# Altium project Subboard.PrjPCB (part 1 of 2)
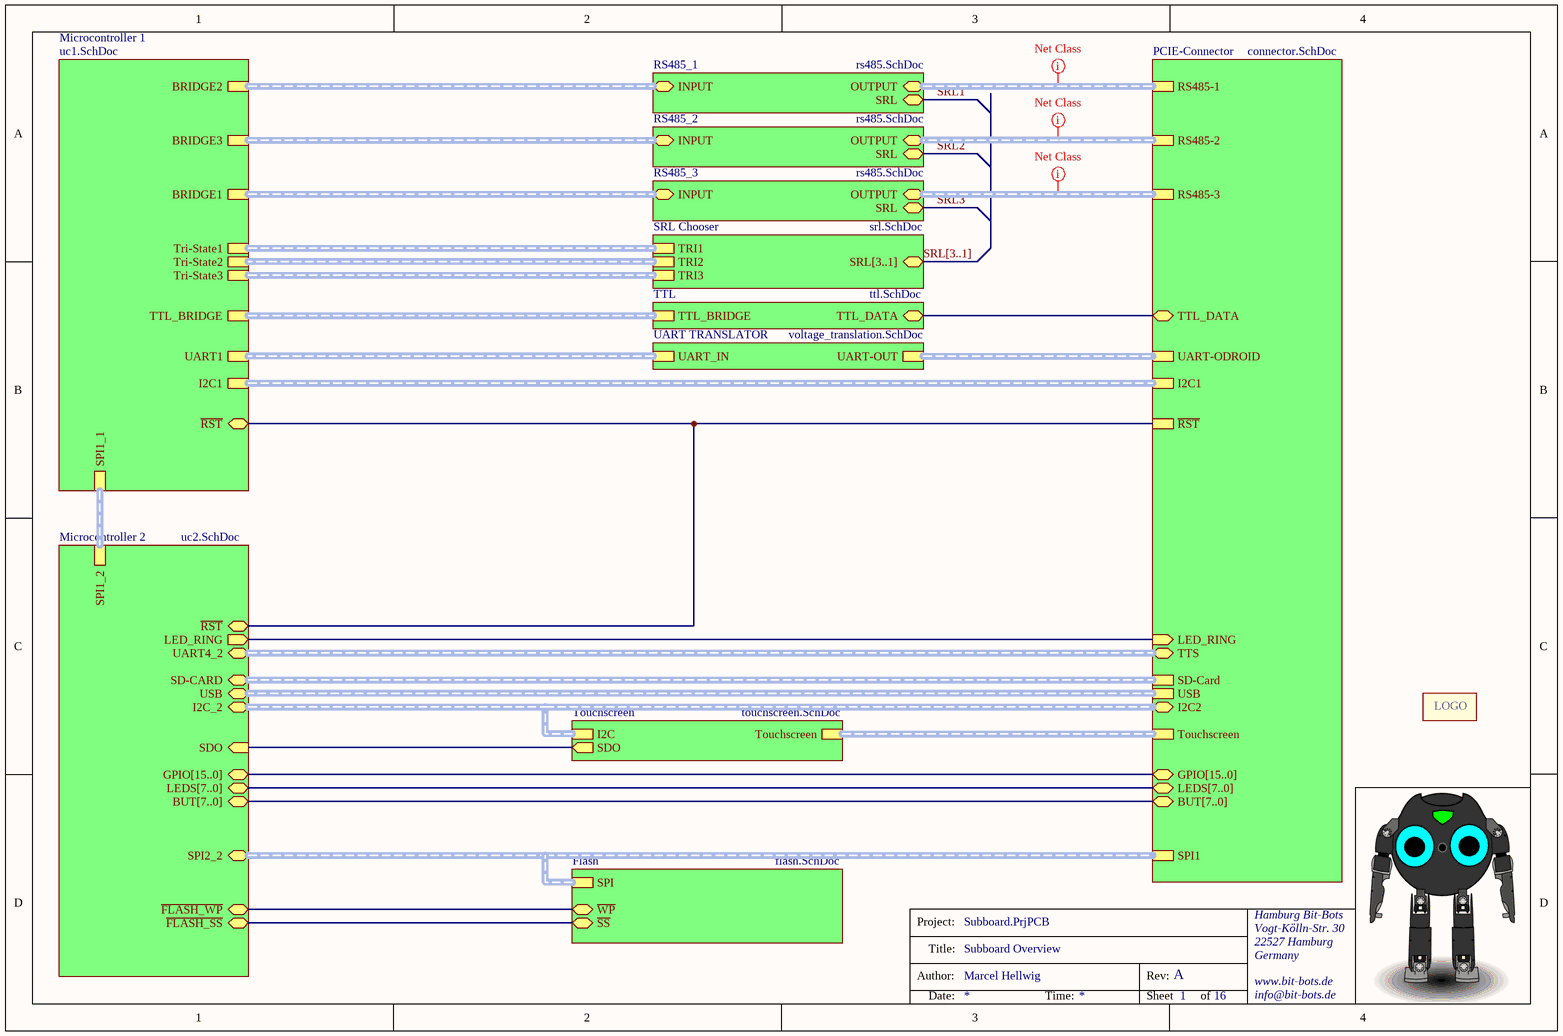
[diagram p0: TopLevel.SchDoc]
ProjectRevision: A
16 sheets, 166 parts. Net scope: hierarchical (ports join the sheet entries above them; power ports are global).
Board file: subboard.PcbDoc
Sheets:
  TopLevel.SchDoc
    RS485_3 = rs485.SchDoc
    PCIE-Connector = connector.SchDoc
    TTL = ttl.SchDoc
    Touchscreen = touchscreen.SchDoc
    RS485_1 = rs485.SchDoc
    RS485_2 = rs485.SchDoc
    SRL Chooser = srl.SchDoc
    UART TRANSLATOR = voltage_translation.SchDoc
    Microcontroller 1 = uc1.SchDoc
      1st Microcontroller = uc1A.SchDoc
      1st Microcontroller = uc1B.SchDoc
      1st Microcontroller = uc1C.SchDoc
    Microcontroller 2 = uc2.SchDoc
      2nd Microcontroller = uc2A.SchDoc
      2nd Microcontroller = uc2B.SchDoc
      2nd Microcontroller = uc2C.SchDoc
    Flash = flash.SchDoc

## Sheet TopLevel.SchDoc: Subboard Overview
size A4; Author: Marcel Hellwig; Organization: Hamburg Bit-Bots; Address1: Vogt-Kölln-Str. 30; Address2: 22527 Hamburg; Address3: Germany; Address4: www.bit-bots.de; DocumentNumber: 1; Revision: A; SheetNumber: 1; SheetTotal: 16; EMail: info@bit-bots.de

### Parts
Logo  Hamburg Bit-Bots Logo  [Logo]  (value not drawn)  (no BOM)

### Sub-sheets
Flash = flash.SchDoc: SPI (harness SPI), ~{WP} (bidir), ~{SS} (bidir)
Microcontroller 1 = uc1.SchDoc: BRIDGE1 (harness UART_RS485), BRIDGE2 (harness UART_RS485), BRIDGE3 (harness UART_RS485), TTL_BRIDGE (harness TTL), I2C1 (harness I²C), SPI1_1 (harness SPI), UART1 (harness UART), ~{RST}, Tri-State1 (harness Tri-State), Tri-State2 (harness Tri-State), Tri-State3 (harness Tri-State)
Microcontroller 2 = uc2.SchDoc: SPI1_2 (harness SPI), SD-CARD (harness SD-Card), USB (harness USB), I2C_2 (harness I²C), ~{RST}, SDO (in), GPIO[15..0] (bidir), LEDS[7..0] (bidir), BUT[7..0] (bidir), SPI2_2 (harness SPI), LED_RING (out), UART4_2 (harness UART), ~{FLASH_WP} (bidir), ~{FLASH_SS} (bidir)
PCIE-Connector = connector.SchDoc: LEDS[7..0] (bidir), BUT[7..0] (bidir), USB (harness USB), ~{RST}, SPI1 (harness SPI), UART-ODROID (harness UART), I2C1 (harness I²C), GPIO[15..0] (bidir), Touchscreen (harness Touchscreen), RS485-1 (harness RS-485), RS485-2 (harness RS-485), RS485-3 (harness RS-485), SD-Card (harness SD-Card), TTL_DATA (bidir), I2C2 (harness I²C), LED_RING (in), TTS (harness UART)
RS485_1 = rs485.SchDoc: SRL (bidir), INPUT (harness UART_RS485), OUTPUT (harness RS-485)
RS485_2 = rs485.SchDoc: SRL (bidir), INPUT (harness UART_RS485), OUTPUT (harness RS-485)
RS485_3 = rs485.SchDoc: SRL (bidir), INPUT (harness UART_RS485), OUTPUT (harness RS-485)
SRL Chooser = srl.SchDoc: SRL[3..1] (bidir), TRI1 (harness Tri-State), TRI2 (harness Tri-State), TRI3 (harness Tri-State)
Touchscreen = touchscreen.SchDoc: I2C (harness I²C), SDO (out), Touchscreen (harness Touchscreen)
TTL = ttl.SchDoc: TTL_BRIDGE (harness TTL), TTL_DATA (bidir)
UART TRANSLATOR = voltage_translation.SchDoc: UART-OUT (harness UART), UART_IN (harness UART)

### Nets
~{FLASH_SS}: sheet Microcontroller 2/~{FLASH_SS}, sheet Flash/~{SS}
~{FLASH_WP}: sheet Microcontroller 2/~{FLASH_WP}, sheet Flash/~{WP}
~{RST}: sheet PCIE-Connector/~{RST}, sheet Microcontroller 1/~{RST}, sheet Microcontroller 2/~{RST}
LED_RING: sheet PCIE-Connector/LED_RING, sheet Microcontroller 2/LED_RING
SDO: sheet Touchscreen/SDO, sheet Microcontroller 2/SDO
TTL_DATA: sheet PCIE-Connector/TTL_DATA, sheet TTL/TTL_DATA

### Buses and harness runs
bus sheet Microcontroller 2/BUT[7..0] = sheet PCIE-Connector/BUT[7..0]
bus sheet Microcontroller 2/GPIO[15..0] = sheet PCIE-Connector/GPIO[15..0]
bus sheet Microcontroller 2/LEDS[7..0] = sheet PCIE-Connector/LEDS[7..0]
bus SRL[3..1] = sheet SRL Chooser/SRL[3..1]
harness sheet Flash/SPI = sheet Microcontroller 2/SPI2_2 = sheet PCIE-Connector/SPI1
harness sheet Microcontroller 1/BRIDGE1 = sheet RS485_3/INPUT
harness sheet Microcontroller 1/BRIDGE2 = sheet RS485_1/INPUT
harness sheet Microcontroller 1/BRIDGE3 = sheet RS485_2/INPUT
harness sheet Microcontroller 1/I2C1 = sheet PCIE-Connector/I2C1
harness sheet Microcontroller 1/SPI1_1 = sheet Microcontroller 2/SPI1_2
harness sheet Microcontroller 1/Tri-State1 = sheet SRL Chooser/TRI1
harness sheet Microcontroller 1/Tri-State2 = sheet SRL Chooser/TRI2
harness sheet Microcontroller 1/Tri-State3 = sheet SRL Chooser/TRI3
harness sheet Microcontroller 1/TTL_BRIDGE = sheet TTL/TTL_BRIDGE
harness sheet Microcontroller 1/UART1 = sheet UART TRANSLATOR/UART_IN
harness sheet Microcontroller 2/I2C_2 = sheet PCIE-Connector/I2C2 = sheet Touchscreen/I2C
harness sheet Microcontroller 2/SD-CARD = sheet PCIE-Connector/SD-Card
harness sheet Microcontroller 2/UART4_2 = sheet PCIE-Connector/TTS
harness sheet Microcontroller 2/USB = sheet PCIE-Connector/USB
harness sheet PCIE-Connector/RS485-1 = sheet RS485_1/OUTPUT
harness sheet PCIE-Connector/RS485-2 = sheet RS485_2/OUTPUT
harness sheet PCIE-Connector/RS485-3 = sheet RS485_3/OUTPUT
harness sheet PCIE-Connector/Touchscreen = sheet Touchscreen/Touchscreen
harness sheet PCIE-Connector/UART-ODROID = sheet UART TRANSLATOR/UART-OUT

### Layout directives
net class RS485: (no net found under the mark)

### Notes on the sheet
- Project:
- Author:
- Title:
- Rev:
- Date:
- Time:
- Sheet
- of
- (in symbol Logo) LOGO

### Library data of the parts
Logo = Logo

## Sheet rs485.SchDoc: RS485
size A4; Author: Marcel Hellwig; Organization: Hamburg Bit-Bots; Address1: Vogt-Kölln-Str. 30; Address2: 22527 Hamburg; Address3: Germany; Address4: www.bit-bots.de; DocumentNumber: 11; Revision: A; SheetNumber: 11; SheetTotal: 16; EMail: info@bit-bots.de
Used 3 times, as channels RS485_3, RS485_1, RS485_2. Parts and nets are listed once, with the designators drawn on the sheet.
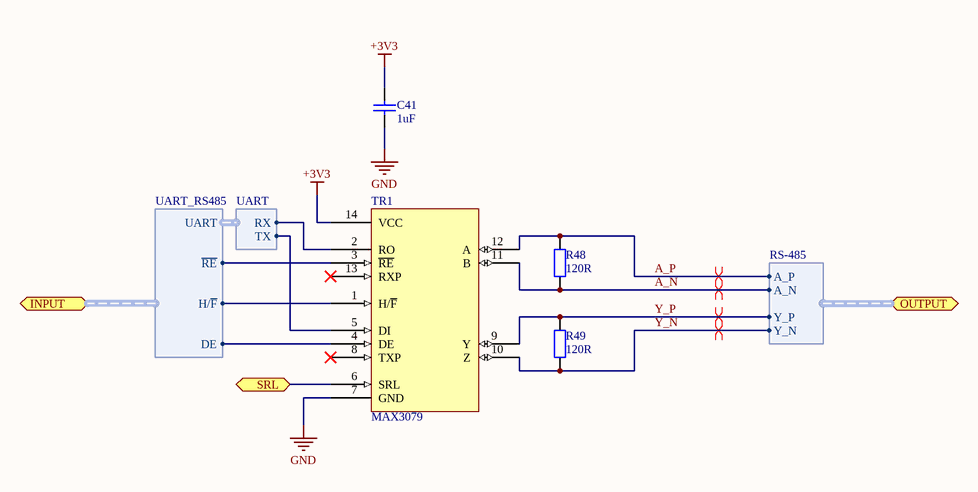
[diagram p1: rs485.SchDoc]

### Parts
C41  1uF  [C2012]
R48  120R  [R2012]
R49  120R  [R2012]
TR1  MAX3079  [SOIC14]

### Ports
INPUT (harness UART_RS485), OUTPUT (harness RS-485), SRL (bidir)

### Harnesses
UART_RS485: ~{RE}, UART, DE, H/~{F}
UART: RX, TX
RS-485: A_N, A_P, Y_N, Y_P

### Nets
+3V3: C41.1 TR1.14(VCC)
GND: C41.2 TR1.7(GND)
A_N: R48.1 TR1.11(B) ; port OUTPUT.A_N
A_P: R48.2 TR1.12(A) ; port OUTPUT.A_P
SRL: TR1.6(SRL) ; port SRL
Y_N: R49.2 TR1.10(Z) ; port OUTPUT.Y_N
Y_P: R49.1 TR1.9(Y) ; port OUTPUT.Y_P
NetTR1_1: TR1.1(H/~{F}) ; port INPUT.H/~{F}
NetTR1_2: TR1.2(RO) ; harness UART.RX
NetTR1_3: TR1.3(~{RE}) ; port INPUT.~{RE}
NetTR1_4: TR1.4(DE) ; port INPUT.DE
NetTR1_5: TR1.5(DI) ; harness UART.TX

Not connected (* = marked no-connect by the designer): TR1 8(TXP)* 13(RXP)*

### Channels
RS485_3: designators end in 1; ports SRL=SRL3
RS485_1: designators end in 2; ports SRL=SRL1
RS485_2: designators end in 3; ports SRL=SRL2

### Layout directives
differential pair: A_N, A_P, Y_N, Y_P

### Notes on the sheet
- Project:
- Author:
- Title:
- Rev:
- Date:
- Time:
- Sheet
- of

### Library data of the parts
C41 = Cap: Capacitor; Manufacturer: MULTICOMP; Manufacturer Part Number: MC0805B105K250CT; Produktpalette: Baureihe MC; Kapazität: 1; Kapazitätstoleranz: ±10%; Dielektrikum: X7; Nennspannung: 25; Keramikkondensatorgehäuse: 0805 [Metrisch 2012]; Betriebstemperatur, min.: -55; Betriebstemperatur, max.: 125; Verpackung: Gurtabschnitt; Kondensatoranschlüsse: SMD<!--FANDB--><div class="features-and-benefits-container"></div>; Published: 8-Jun-2000; LatestRevisionDate: 17-Jul-2002; LatestRevisionNote: Re-released for DXP Platform.; PackageReference: RAD-0.3; Publisher: Altium Limited; PackageDescription: Radial Cap, Thru-Hole; 2 Leads; 0.3 in Pin Spacing; Value: 1uF; Supplier 1: Farnell; Supplier Part Number 1: 2320827; RoHS: YES; Stock 1: 4031; Pricing 1: 10=0,06, 100=0,05, 500=0,041, 1000=0,034, 1500=0,027 (EUR); MSL: MSL 1 - unbegrenzt; Bauform: 0805 [Metrisch 2012]; Kapazitätstoleranz ±: ±10%; ComponentLink1URL: http://www.farnell.com/datasheets/1870456.pdf; ComponentLink1Description: http://www.farnell.com/datasheets/1870456.pdf
R48 R49 = Res2: Resistor; Manufacturer: MULTICOMP; Manufacturer Part Number: MCMR08X1200FTL; Produktpalette: Baureihe MCMR; Widerstand: 120; Nennleistung: 125; Widerstandstoleranz: ±1%; Bauform: 0805 [Metrisch 2012]; Widerstandselement: Keramik; Temperaturkoeffizient: ±100; Nennspannung: 150; Verpackung: Gurtabschnitt; SVHC: No SVHC (17-Dec-2014); Widerstandsmontage: Oberflächenmontage<!--FANDB--><div class="features-and-benefits-container"></div>; Published: 8-Jun-2000; LatestRevisionDate: 17-Jul-2002; LatestRevisionNote: Re-released for DXP Platform.; PackageReference: AXIAL-0.4; Publisher: Altium Limited; PackageDescription: Axial Device, Thru-Hole; 2 Leads; 0.4 in Pin Spacing; Value: 120R; Supplier 1: Farnell; Supplier Part Number 1: 2073624; RoHS: YES; Stock 1: 7400; Pricing 1: 100=0,014, 500=0,011, 1000=0,01 (EUR); MSL: -; ComponentLink1URL: http://www.farnell.com/datasheets/1716708.pdf; ComponentLink1Description: http://www.farnell.com/datasheets/1716708.pdf
TR1 = MAX3079: MAX3079 RS485-Transreceiver; Supplier 1: Farnell; Supplier Part Number 1: 1379892

## Sheet connector.SchDoc: PCIE-Connector
size A4; Author: Marcel Hellwig; Organization: Hamburg Bit-Bots; Address1: Vogt-Kölln-Str. 30; Address2: 22527 Hamburg; Address3: Germany; Address4: www.bit-bots.de; DocumentNumber: 10; Revision: A; SheetNumber: 10; SheetTotal: 16; EMail: info@bit-bots.de
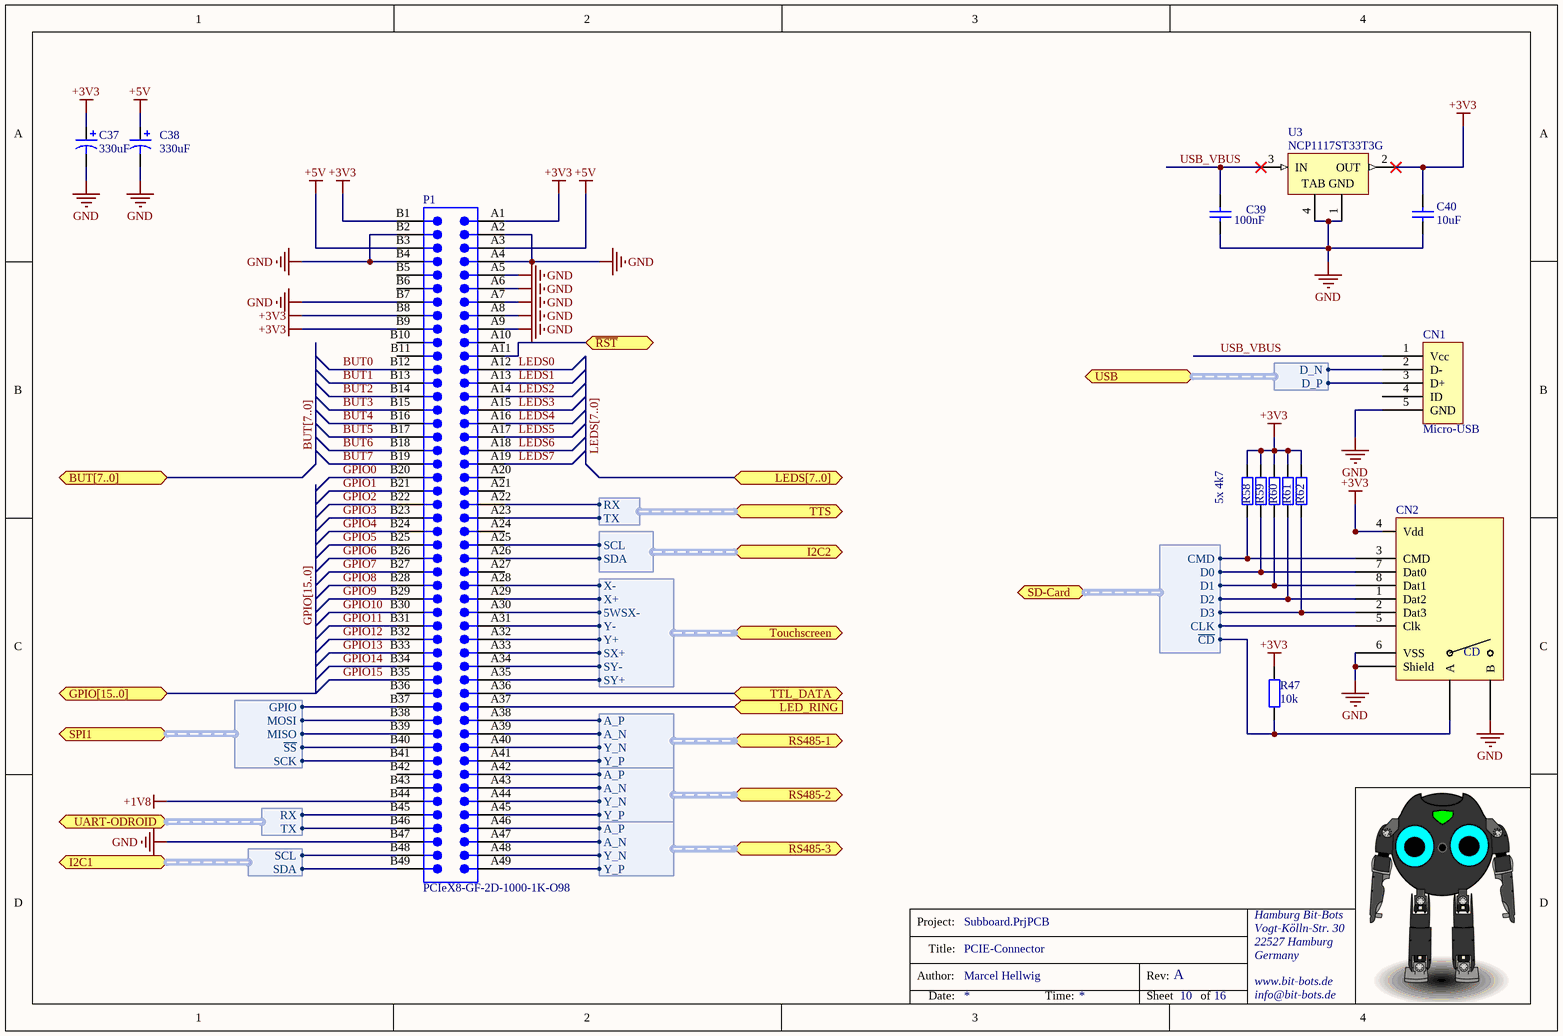
[diagram p2: connector.SchDoc]

### Parts
C37  330uF  [Cap 10mm]
C38  330uF  [Cap 10mm]
C39  100nF  [C2012]
C40  10uF  [C2012]
CN1  Micro-USB  [USB-MicroB]
CN2  microSD  [Microsd]  (value not drawn)
P1  PCIeX8-GF-2D-1000-1K-O98  [PCIeX8-GF-2D-1000-1K-O98]  (no BOM)
R47  10k  [R2012]
R58  4k7  [R2012]  (value not drawn)
R59  4k7  [R2012]  (value not drawn)
R60  4k7  [R2012]  (value not drawn)
R61  4k7  [R2012]  (value not drawn)
R62  4k7  [R2012]  (value not drawn)
U3  NCP1117ST33T3G  [ONSC-SOT-223_L]

### Ports
BUT[7..0] (bidir), GPIO[15..0] (bidir), I2C1 (harness I²C), I2C2 (harness I²C), LED_RING (in), LEDS[7..0] (bidir), RS485-1 (harness RS-485), RS485-2 (harness RS-485), RS485-3 (harness RS-485), SD-Card (harness SD-Card), SPI1 (harness SPI), Touchscreen (harness Touchscreen), TTL_DATA (bidir), TTS (harness UART), UART-ODROID (harness UART), USB (harness USB), ~{RST}

### Harnesses
USB: D_N, D_P
UART: RX, TX
I²C: SCL, SDA
Touchscreen: 5WSX-, SX+, SY-, SY+, X-, X+, Y-, Y+
RS-485: A_P, A_N, Y_P, Y_N
SD-Card: CLK, CMD, D0, D1, D2, D3, ~{CD}
SPI: ~{SS}, GPIO, MISO, MOSI, SCK

### Nets
+1V8: P1.B44
+3V3: C37.1 C40.2 CN2.4(Vdd) P1.A1 P1.B1 P1.B8 P1.B9 R47.2 R58.1 R59.1 R60.1 R61.1 R62.1 U3.2(OUT)
+5V: C38.1 P1.A3 P1.B3
GND: C37.2 C38.2 C39.1 C40.1 CN1.5(GND) CN2.6(VSS) CN2.B CN2.sh(Shield) P1.A2 P1.A4 P1.A5 P1.A6 P1.A7 P1.A8 P1.A9 P1.B2 P1.B4 P1.B7 P1.B47 U3.1(GND) U3.4(TAB)
~{RST}: P1.A11 ; port ~{RST}
A_N: P1.A47 ; port RS485-3.A_N
A_N: P1.A39 ; port RS485-1.A_N  [a separate net that carries the same name]
A_N: P1.A43 ; port RS485-2.A_N  [a separate net that carries the same name]
A_P: P1.A46 ; port RS485-3.A_P
A_P: P1.A38 ; port RS485-1.A_P  [a separate net that carries the same name]
A_P: P1.A42 ; port RS485-2.A_P  [a separate net that carries the same name]
BUT0: P1.B12
BUT1: P1.B13
BUT2: P1.B14
BUT3: P1.B15
BUT4: P1.B16
BUT5: P1.B17
BUT6: P1.B18
BUT7: P1.B19
GPIO0: P1.B20
GPIO1: P1.B21
GPIO2: P1.B22
GPIO3: P1.B23
GPIO4: P1.B24
GPIO5: P1.B25
GPIO6: P1.B26
GPIO7: P1.B27
GPIO8: P1.B28
GPIO9: P1.B29
GPIO10: P1.B30
GPIO11: P1.B31
GPIO12: P1.B32
GPIO13: P1.B33
GPIO14: P1.B34
GPIO15: P1.B35
LED_RING: P1.A37 ; port LED_RING
LEDS0: P1.A12
LEDS1: P1.A13
LEDS2: P1.A14
LEDS3: P1.A15
LEDS4: P1.A16
LEDS5: P1.A17
LEDS6: P1.A18
LEDS7: P1.A19
SD-CARD.CMD: CN2.3(CMD) R58.2 ; port SD-Card.CMD
SPI2~{.}SS: P1.B40 ; port SPI1.~{SS}
SPI2.GPIO: P1.B37 ; port SPI1.GPIO
SPI2.SCK: P1.B41 ; port SPI1.SCK
Touchscreen.X-: P1.A28 ; port Touchscreen.X-
TTL_DATA: P1.A36 ; port TTL_DATA
USB_VBUS: C39.2 CN1.1(Vcc) U3.3(IN)
Y_N: P1.A48 ; port RS485-3.Y_N
Y_N: P1.A40 ; port RS485-1.Y_N  [a separate net that carries the same name]
Y_N: P1.A44 ; port RS485-2.Y_N  [a separate net that carries the same name]
Y_P: P1.A49 ; port RS485-3.Y_P
Y_P: P1.A41 ; port RS485-1.Y_P  [a separate net that carries the same name]
Y_P: P1.A45 ; port RS485-2.Y_P  [a separate net that carries the same name]
NetC47_2: P1.A30 ; port Touchscreen.5WSX-
NetC48_2: P1.A31 ; port Touchscreen.Y-
NetC49_2: P1.A34 ; port Touchscreen.SY-
NetCN1_2: CN1.2(D-) ; port USB.D_N
NetCN1_3: CN1.3(D+) ; port USB.D_P
NetCN2_1: CN2.1(Dat2) R61.2 ; port SD-Card.D2
NetCN2_2: CN2.2(Dat3) R62.2 ; port SD-Card.D3
NetCN2_5: CN2.5(Clk) ; port SD-Card.CLK
NetCN2_7: CN2.7(Dat0) R59.2 ; port SD-Card.D0
NetCN2_8: CN2.8(Dat1) R60.2 ; port SD-Card.D1
NetCN2_A: CN2.A R47.1 ; port SD-Card.~{CD}
NetP1_A22: P1.A22 ; port TTS.RX
NetP1_A23: P1.A23 ; port TTS.TX
NetP1_A25: P1.A25 ; port I2C2.SCL
NetP1_A26: P1.A26 ; port I2C2.SDA
NetP1_A29: P1.A29 ; port Touchscreen.X+
NetP1_A32: P1.A32 ; port Touchscreen.Y+
NetP1_A33: P1.A33 ; port Touchscreen.SX+
NetP1_A35: P1.A35 ; port Touchscreen.SY+
NetP1_B38: P1.B38 ; port SPI1.MOSI
NetP1_B39: P1.B39 ; port SPI1.MISO
NetP1_B45: P1.B45 ; port UART-ODROID.RX
NetP1_B46: P1.B46 ; port UART-ODROID.TX
NetP1_B48: P1.B48 ; port I2C1.SCL
NetP1_B49: P1.B49 ; port I2C1.SDA

Not connected (* = marked no-connect by the designer): CN1 4(ID); P1 A10 A20 A21 A24 A27 B5 B6 B10 B11 B36 B42 B43

### Buses and harness runs
bus BUT[7..0] = port BUT[7..0]
bus GPIO[15..0] = port GPIO[15..0]
bus LEDS[7..0] = port LEDS[7..0]

### Notes on the sheet
- 5x 4k7
- Project:
- Author:
- Title:
- Rev:
- Date:
- Time:
- Sheet
- of
- (in symbol microSD) CD

### Library data of the parts
C37 C38 = Cap Pol1: Polarized Capacitor (Radial); Manufacturer: PANASONIC ELECTRONIC COMPONENTS; Manufacturer Part Number: EEE1VA331UAP; Published: 8-Jun-2000; LatestRevisionDate: 17-Jul-2002; LatestRevisionNote: Re-released for DXP Platform.; PackageReference: RB7.6-15; Publisher: Altium Limited; PackageDescription: Polarized Capacitor (Radial); 2 Leads; Value: 330uF; Supplier 1: Farnell; Supplier Part Number 1: 2326180; RoHS: YES; Stock 1: 534; Pricing 1: 1=0,89, 10=0,619, 50=0,445, 100=0,309, 250=0,279, 500=0,259, 2500=0,219, 5000=0,195 (EUR); ComponentLink1URL: http://www.farnell.com/datasheets/1790637.pdf; ComponentLink1Description: http://www.farnell.com/datasheets/1790637.pdf
C39 = Cap: Capacitor; Manufacturer: MULTICOMP; Manufacturer Part Number: MC0805B104K500CT; Produktpalette: Baureihe MC; Kapazität: 0.1; Kapazitätstoleranz: ±10%; Dielektrikum: X7; Nennspannung: 50; Keramikkondensatorgehäuse: 0805 [Metrisch 2012]; Betriebstemperatur, min.: -55; Betriebstemperatur, max.: 125; Verpackung: Gurtabschnitt; SVHC: No SVHC (17-Dec-2014); Betriebstemperatur: -55°C bis +125; Kondensatoranschlüsse: SMD<!--FANDB--><div class="features-and-benefits-container"></div>; Published: 8-Jun-2000; LatestRevisionDate: 17-Jul-2002; LatestRevisionNote: Re-released for DXP Platform.; PackageReference: RAD-0.3; Publisher: Altium Limited; PackageDescription: Radial Cap, Thru-Hole; 2 Leads; 0.3 in Pin Spacing; Value: 100nF; Supplier 1: Farnell; Supplier Part Number 1: 1759265; RoHS: YES; Stock 1: 692587; Pricing 1: 10=0,013, 100=0,011, 500=0,009, 1000=0,008, 2000=0,006 (EUR); MSL: -; Bauform: 0805 [Metrisch 2012]; Kapazitätstoleranz ±: ±10%; ComponentLink1URL: http://www.farnell.com/datasheets/1870456.pdf; ComponentLink1Description: http://www.farnell.com/datasheets/1870456.pdf
C40 = Cap: Capacitor; Manufacturer: MULTICOMP; Manufacturer Part Number: MC0805X106K250CT; Produktpalette: Baureihe MC; Kapazität: 10; Kapazitätstoleranz: ±10%; Dielektrikum: X5; Nennspannung: 25; Keramikkondensatorgehäuse: 0805 [Metrisch 2012]; Betriebstemperatur, min.: -55; Betriebstemperatur, max.: 85; Verpackung: Gurtabschnitt; Kondensatoranschlüsse: SMD<!--FANDB--><div class="features-and-benefits-container"></div>; Published: 8-Jun-2000; LatestRevisionDate: 17-Jul-2002; LatestRevisionNote: Re-released for DXP Platform.; PackageReference: RAD-0.3; Publisher: Altium Limited; PackageDescription: Radial Cap, Thru-Hole; 2 Leads; 0.3 in Pin Spacing; Value: 10uF; Supplier 1: Farnell; Supplier Part Number 1: 2320833; RoHS: YES; Stock 1: 46180; Pricing 1: 10=0,147, 100=0,121, 500=0,1, 1000=0,083, 1500=0,066 (EUR); MSL: MSL 1 - unbegrenzt; Bauform: 0805 [Metrisch 2012]; Kapazitätstoleranz ±: ±10%; ComponentLink1URL: http://www.farnell.com/datasheets/1870456.pdf; ComponentLink1Description: http://www.farnell.com/datasheets/1870456.pdf
CN1 = USB-MicroB: Manufacturer: Molex; Manufacturer Part Number: 105017-0001; Verbindungstyp: Micro USB Type B Receptacle; Kontaktüberzug: Gold; Nennstrom: 1.8 A; Anschlussart: Male; Anzahl der Kontakte: 5; Verpackung: Reel; Produkt: Micro USB Type B Connectors; Serie: 105017; Klemmenart: Solder Tab; Nennspannung: 30 VAC; Kontaktmaterial: Copper Alloy; Anzahl der Ports: 1; Produktkategorie: USB Connectors; Supplier 1: Mouser; Supplier Part Number 1: 538-105017-0001; RoHS: RoHS Compliant; Category: USB-Stecker; Stock 1: 8793; Pricing 1: 1=0.787, 10=0.691, 25=0.650, 50=0.623, 100=0.595, 250=0.507, 500=0.480, 1000=0.389, 2000=0.326 (EUR); Fabrikat: Molex; Hersteller: Molex; Standardpackungsmenge: 14000; RoHS - Mouser: Y; Minimum Order Quantity: 1; Reeling: True; ComponentLink1URL: http://www.mouser.com/ds/2/276/1050170001_IO_CONNECTORS-230168.pdf; ComponentLink1Description: http://www.mouser.com/ds/2/276/1050170001_IO_CONNECTORS-230168.pdf
CN2 = microSD: Micro SD Card Connector; Supplier 1: Farnell; Supplier Part Number 1: 2427719
P1 = CMP-0001-00032-2: Golden finger, PCIeX8, Dual, Opposite, Pitch 1mm, 98-Position; Mating Connector: Molex-87715-9205; Datasheet Version: rev2.0, Apr-2007; ClassName: Edge Connector; Publisher: Altium; Package Reference: PCIeX8-GF-2D-1000-1K-O98
R47 = Res2: Resistor; Manufacturer: MULTICOMP; Manufacturer Part Number: MC01W0805110K; Published: 8-Jun-2000; LatestRevisionDate: 17-Jul-2002; LatestRevisionNote: Re-released for DXP Platform.; PackageReference: AXIAL-0.4; Publisher: Altium Limited; PackageDescription: Axial Device, Thru-Hole; 2 Leads; 0.4 in Pin Spacing; Value: 10k; Supplier 1: Farnell; Supplier Part Number 1: 9332391; RoHS: Y-EX; Stock 1: 4370; Pricing 1: 50=0,038, 250=0,031, 1000=0,022, 5000=0,014, 15000=0,009 (EUR); ComponentLink1URL: http://www.farnell.com/datasheets/1729047.pdf; ComponentLink1Description: http://www.farnell.com/datasheets/1729047.pdf; ComponentLink2URL: http://www.farnell.com/cad/1561156.zip; ComponentLink2Description: http://www.farnell.com/cad/1561156.zip
R58-R62 = Res2: Resistor; Manufacturer: MULTICOMP; Manufacturer Part Number: MC01W080514K7; Produktpalette: Baureihe MC; Widerstand: 4.7; Nennleistung: 100; Widerstandstoleranz: ±1%; Bauform: 0805 [Metrisch 2012]; Widerstandselement: Dickschicht; Temperaturkoeffizient: ±100; Nennspannung: 150; Verpackung: Gurtabschnitt; SVHC: No SVHC (17-Dec-2014); Anzahl der Pins: 2; Außenbreite: 1.25; Außentiefe: 0.55; Bandbreite: 8; Baureihe: MC; Betriebstemperatur: -55°C bis +155; Betriebstemperatur, max.: 155; Betriebstemperatur, min.: -55; Menge pro Rolle: 5000; Toleranz (+): 1%; Widerstandsmontage: Oberflächenmontage<!--FANDB--><div class="features-and-benefits-container"></div>; Published: 8-Jun-2000; LatestRevisionDate: 17-Jul-2002; LatestRevisionNote: Re-released for DXP Platform.; PackageReference: AXIAL-0.4; Publisher: Altium Limited; PackageDescription: Axial Device, Thru-Hole; 2 Leads; 0.4 in Pin Spacing; Value: 4k7; Supplier 1: Farnell; Supplier Part Number 1: 9333266; RoHS: Y-EX; Stock 1: 190984; Pricing 1: 50=0,038, 250=0,031, 1000=0,022, 5000=0,014, 15000=0,009 (EUR); MSL: -; Außenlänge/-höhe: 2; Nennspannung, V DC: 150; Temperaturkoeffizient, +: 100; Temperaturkoeffizient, -: 100; Toleranz (-): 1%; ComponentLink1URL: http://www.farnell.com/datasheets/1729047.pdf; ComponentLink1Description: http://www.farnell.com/datasheets/1729047.pdf; ComponentLink2URL: http://www.farnell.com/cad/1561170.zip; ComponentLink2Description: http://www.farnell.com/cad/1561170.zip
U3 = CMP-0592-00001-2: 1.0 A Low-Dropout Positive Fixed Voltage Regulator, 5 V Vout, 0 to 125 degC, 4-Pin SOT-223, Pb-Free, Tape and Reel; PartNumber: NCP1117ST50T3G; Manufacturer: ON Semiconductor; IQ: 6 mA; Iout (Min): 1 A; Nominal Output Voltage: 3.3 V; Vin: 20 V; RR: 61 dB; Dropout Voltage: 1.2 V; Packing: Tape and Reel; DatasheetVersion: Rev. 26; ComponentLink3URL: http://www.onsemi.com/pub_link/Collateral/318H-01.PDF; ComponentLink2URL: http://www.onsemi.com/pub_link/Collateral/NCP1117-D.PDF; Mounting Technology: Surface Mount; ComponentLink2Description: Datasheet; Operating Temperature: 0 to 125 degC; ComponentLink1Description: Manufacturer URL; PackageDescription: 4-Pin Small Out-Line Transistor, Body 3.5 x 6.5 mm, Pitch 2.3 mm; ComponentLink1URL: http://www.onsemi.com/; PackageReference: SOT-223; ComponentLink3Description: Package Specification; Supplier 1: Farnell; Supplier Part Number 1: 1652366

## Sheet ttl.SchDoc: TTL
size A4; Author: Marcel Hellwig; Organization: Hamburg Bit-Bots; Address1: Vogt-Kölln-Str. 30; Address2: 22527 Hamburg; Address3: Germany; Address4: www.bit-bots.de; DocumentNumber: 13; Revision: A; SheetNumber: 13; SheetTotal: 16; EMail: info@bit-bots.de
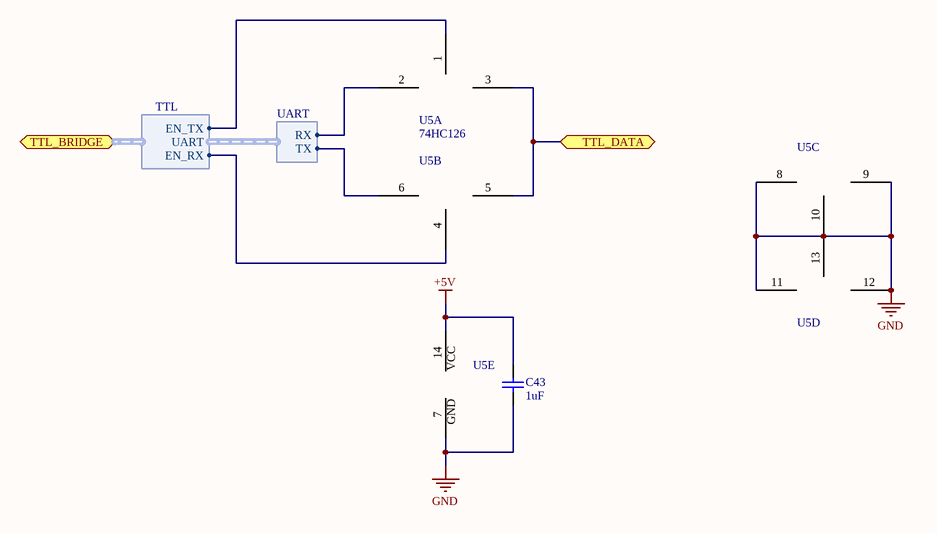
[diagram p3: ttl.SchDoc]

### Parts
C43  1uF  [C2012]
U5  74HC126  [SOIC14]  (parts A,B,C,D,E of 5)

### Ports
TTL_BRIDGE (harness TTL), TTL_DATA (bidir)

### Harnesses
TTL: UART, EN_RX, EN_TX
UART: RX, TX

### Nets
+5V: C43.1 U5.14(VCC)
GND: C43.2 U5.7(GND) U5.8(Y3) U5.9(A3) U5.10(OE3) U5.11(Y4) U5.12(A4) U5.13(OE4)
TTL_BRIDGE.EN_RX: U5.4(OE2) ; port TTL_BRIDGE.EN_RX
TTL_BRIDGE.EN_TX: U5.1(OE1) ; port TTL_BRIDGE.EN_TX
TTL_DATA: U5.3(Y1) U5.5(A2) ; port TTL_DATA
NetU1_96: U5.6(Y2) ; harness UART.TX
NetU1_97: U5.2(A1) ; harness UART.RX

### Notes on the sheet
- Project:
- Author:
- Title:
- Rev:
- Date:
- Time:
- Sheet
- of

### Library data of the parts
C43 = Cap: as C41 on sheet rs485; Published: 8-Jun-2000; LatestRevisionDate: 17-Jul-2002; LatestRevisionNote: Re-released for DXP Platform.; PackageReference: RAD-0.3; Publisher: Altium Limited; PackageDescription: Radial Cap, Thru-Hole; 2 Leads; 0.3 in Pin Spacing; Value: 1uF; Supplier 1: Farnell; Supplier Part Number 1: 2320827; RoHS: YES; Stock 1: 4031; Pricing 1: 10=0,06, 100=0,05, 500=0,041, 1000=0,034, 1500=0,027 (EUR); MSL: MSL 1 - unbegrenzt; Bauform: 0805 [Metrisch 2012]; Kapazitätstoleranz ±: ±10%; ComponentLink1URL: http://www.farnell.com/datasheets/1870456.pdf; ComponentLink1Description: http://www.farnell.com/datasheets/1870456.pdf
U5 = 74HC126: Quad 3-State Noninverting Buffer; Manufacturer: NXP; Manufacturer Part Number: 74HC126D; Supplier 1: Farnell; Supplier Part Number 1: 1085233; RoHS: YES; Stock 1: 198; Pricing 1: 1=0,444, 10=0,311, 100=0,214, 200=0,193, 500=0,173, 2000=0,155, 5000=0,0826, 20000=0,0733 (EUR); ComponentLink1URL: http://www.farnell.com/datasheets/1852048.pdf; ComponentLink1Description: http://www.farnell.com/datasheets/1852048.pdf; ComponentLink2URL: http://www.farnell.com/cad/1638396.zip; ComponentLink2Description: http://www.farnell.com/cad/1638396.zip

## Sheet touchscreen.SchDoc: Touchscreen
size A4; Author: Marcel Hellwig; Organization: Hamburg Bit-Bots; Address1: Vogt-Kölln-Str. 30; Address2: 22527 Hamburg; Address3: Germany; Address4: www.bit-bots.de; DocumentNumber: 14; Revision: A; SheetNumber: 14; SheetTotal: 16; EMail: info@bit-bots.de
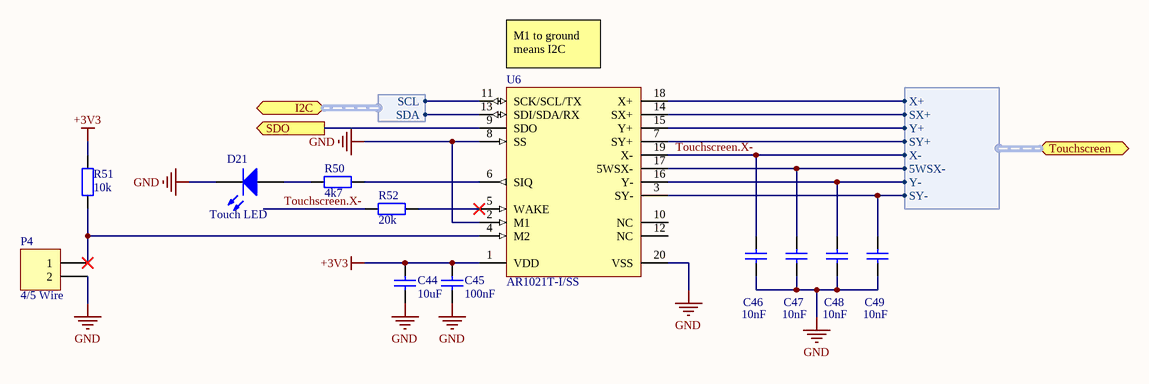
[diagram p4: touchscreen.SchDoc]

### Parts
C44  10uF  [C2012]
C45  100nF  [C2012]
C46  10nF  [C2012]
C47  10nF  [C2012]
C48  10nF  [C2012]
C49  10nF  [C2012]
D21  Touch LED  [MLCC2]
P4  4/5 Wire  [HDR1X2]  (no BOM)
R50  4k7  [R2012]
R51  10k  [R2012]
R52  20k  [R2012]
U6  AR1021T-I/SS  [MCHP-SSOP-SS20_N]

### Ports
I2C (harness I²C), SDO (out), Touchscreen (harness Touchscreen)

### Harnesses
I²C: SCL, SDA
Touchscreen: X+, SX+, Y+, SY+, X-, 5WSX-, Y-, SY-

### Nets
+3V3: C44.1 C45.1 R51.2 U6.1(VDD)
GND: C44.2 C45.2 C46.1 C47.1 C48.1 C49.1 D21.2(K) P4.2 U6.2(M1) U6.8(SS) U6.20(VSS)
SDO: U6.9(SDO) ; port SDO
Touchscreen.X-: C46.2 R52.1 U6.19(X-) ; port Touchscreen.X-
NetC47_2: C47.2 U6.17(5WSX-) ; port Touchscreen.5WSX-
NetC48_2: C48.2 U6.16(Y-) ; port Touchscreen.Y-
NetC49_2: C49.2 U6.3(SY-) ; port Touchscreen.SY-
NetD21_1: D21.1(A) R50.1
NetP1_A25: U6.11(SCK/SCL/TX) ; port I2C.SCL
NetP1_A26: U6.13(SDI/SDA/RX) ; port I2C.SDA
NetP1_A29: U6.18(X+) ; port Touchscreen.X+
NetP1_A32: U6.15(Y+) ; port Touchscreen.Y+
NetP1_A33: U6.14(SX+) ; port Touchscreen.SX+
NetP1_A35: U6.7(SY+) ; port Touchscreen.SY+
NetP4_1: P4.1 R51.1 U6.4(M2)
NetR50_2: R50.2 U6.6(SIQ)
NetR52_2: R52.2 U6.5(WAKE)

Not connected (* = marked no-connect by the designer): U6 10(NC) 12(NC)

### Notes on the sheet
- (near U6) M1 to ground means I2C
- Project:
- Author:
- Title:
- Rev:
- Date:
- Time:
- Sheet
- of

### Library data of the parts
C44 = Cap: as C40 on sheet connector; Published: 8-Jun-2000; LatestRevisionDate: 17-Jul-2002; LatestRevisionNote: Re-released for DXP Platform.; PackageReference: RAD-0.3; Publisher: Altium Limited; PackageDescription: Radial Cap, Thru-Hole; 2 Leads; 0.3 in Pin Spacing; Value: 10uF; Supplier 1: Farnell; Supplier Part Number 1: 2320833; RoHS: YES; Stock 1: 46180; Pricing 1: 10=0,147, 100=0,121, 500=0,1, 1000=0,083, 1500=0,066 (EUR); MSL: MSL 1 - unbegrenzt; Bauform: 0805 [Metrisch 2012]; Kapazitätstoleranz ±: ±10%; ComponentLink1URL: http://www.farnell.com/datasheets/1870456.pdf; ComponentLink1Description: http://www.farnell.com/datasheets/1870456.pdf
C45 = Cap: as C39 on sheet connector; Published: 8-Jun-2000; LatestRevisionDate: 17-Jul-2002; LatestRevisionNote: Re-released for DXP Platform.; PackageReference: RAD-0.3; Publisher: Altium Limited; PackageDescription: Radial Cap, Thru-Hole; 2 Leads; 0.3 in Pin Spacing; Value: 100nF; Supplier 1: Farnell; Supplier Part Number 1: 1759265; RoHS: YES; Stock 1: 692437; Pricing 1: 10=0,013, 100=0,011, 500=0,009, 1000=0,008, 2000=0,006 (EUR); MSL: -; Bauform: 0805 [Metrisch 2012]; Kapazitätstoleranz ±: ±10%; ComponentLink1URL: http://www.farnell.com/datasheets/1870456.pdf; ComponentLink1Description: http://www.farnell.com/datasheets/1870456.pdf
C46-C49 = Cap: Capacitor; Manufacturer: MULTICOMP; Manufacturer Part Number: MC0805B103K500CT; Produktpalette: Baureihe MC; Kapazität: 0.01; Kapazitätstoleranz: ±10%; Dielektrikum: X7; Nennspannung: 50; Keramikkondensatorgehäuse: 0805 [Metrisch 2012]; Betriebstemperatur, min.: -55; Betriebstemperatur, max.: 125; Verpackung: Gurtabschnitt; SVHC: No SVHC (17-Dec-2014); Betriebstemperatur: -55°C bis +125; Kondensatoranschlüsse: SMD<!--FANDB--><div class="features-and-benefits-container"></div>; Published: 8-Jun-2000; LatestRevisionDate: 17-Jul-2002; LatestRevisionNote: Re-released for DXP Platform.; PackageReference: RAD-0.3; Publisher: Altium Limited; PackageDescription: Radial Cap, Thru-Hole; 2 Leads; 0.3 in Pin Spacing; Value: 10nF; Supplier 1: Farnell; Supplier Part Number 1: 1759246; RoHS: YES; Stock 1: 268277; Pricing 1: 10=0,013, 100=0,011, 500=0,009, 1000=0,008, 2000=0,006 (EUR); MSL: -; Bauform: 0805 [Metrisch 2012]; Kapazitätstoleranz ±: ±10%; ComponentLink1URL: http://www.farnell.com/datasheets/1870456.pdf; ComponentLink1Description: http://www.farnell.com/datasheets/1870456.pdf
D21 = LED0: Typical INFRARED GaAs LED; Manufacturer: VISHAY; Manufacturer Part Number: VLMC3100-GS08; Leuchtengröße: 2.4; LED-Farbe: Grün; Lichtstärke: 1.6; Abstrahlwinkel: 120°; Durchlassstrom If: 2; Durchlassspannung: 1.9; LED-Montage: Oberflächenmontage; Linsenform: Rund; Wellenlänge, typ.: 575; Verpackung: Gurtabschnitt; SVHC: No SVHC (16-Jun-2014); Betriebstemperatur: -40°C bis +100; Betriebstemperatur, max.: 100; Betriebstemperatur, min.: -40; LED-Typ: Standard; LED/Lampen Größe: PLCC-2; Montage: SMD; Sperrspannung: 6; Spitzenwellenlänge: 565; Winkel halber Empfindlichkeit ±: 60; Published: 8-Jun-2000; LatestRevisionDate: 08-Jul-2005; LatestRevisionNote: Mech Layer 1 removed.; PackageReference: LED-0; Publisher: Altium Limited; PackageDescription: LED; 2 Leads; Supplier 1: Farnell; Supplier Part Number 1: 1659076; RoHS: YES; Stock 1: 12975; Pricing 1: 5=0,105, 25=0,0998, 100=0,0952, 250=0,0917, 500=0,0865, 2000=0,0771, 4000=0,0717, 20000=0,0689 (EUR); MSL: MSL 2A - 4 Wochen; Anzahl der Pins: 2; Dominante Wellenlänge: 575; Durchlassspannung Vf max.: 2.4; Durchlassstrom If, max.: 2; Lichtstärke, typ.: 1.6; ComponentLink1URL: http://www.farnell.com/datasheets/1698102.pdf; ComponentLink1Description: http://www.farnell.com/datasheets/1698102.pdf
P4 = Header 2: Header, 2-Pin; LatestRevisionDate: 17-Jul-2002; LatestRevisionNote: Re-released for DXP Platform.; Publisher: Altium Limited
R50 = Res2: Resistor; Manufacturer: MULTICOMP; Manufacturer Part Number: MC01W080514K7; Published: 8-Jun-2000; LatestRevisionDate: 17-Jul-2002; LatestRevisionNote: Re-released for DXP Platform.; PackageReference: AXIAL-0.4; Publisher: Altium Limited; PackageDescription: Axial Device, Thru-Hole; 2 Leads; 0.4 in Pin Spacing; Value: 4k7; Supplier 1: Farnell; Supplier Part Number 1: 9333266; RoHS: Y-EX; Stock 1: 190984; Pricing 1: 50=0,038, 250=0,031, 1000=0,022, 5000=0,014, 15000=0,009 (EUR); ComponentLink1URL: http://www.farnell.com/datasheets/1729047.pdf; ComponentLink1Description: http://www.farnell.com/datasheets/1729047.pdf; ComponentLink2URL: http://www.farnell.com/cad/1561170.zip; ComponentLink2Description: http://www.farnell.com/cad/1561170.zip
R51 = Res2: as R47 on sheet connector; Published: 8-Jun-2000; LatestRevisionDate: 17-Jul-2002; LatestRevisionNote: Re-released for DXP Platform.; PackageReference: AXIAL-0.4; Publisher: Altium Limited; PackageDescription: Axial Device, Thru-Hole; 2 Leads; 0.4 in Pin Spacing; Value: 10k; Supplier 1: Farnell; Supplier Part Number 1: 9332391; RoHS: Y-EX; Stock 1: 4370; Pricing 1: 50=0,038, 250=0,031, 1000=0,022, 5000=0,014, 15000=0,009 (EUR); ComponentLink1URL: http://www.farnell.com/datasheets/1729047.pdf; ComponentLink1Description: http://www.farnell.com/datasheets/1729047.pdf; ComponentLink2URL: http://www.farnell.com/cad/1561156.zip; ComponentLink2Description: http://www.farnell.com/cad/1561156.zip
R52 = Res2: Resistor; Manufacturer: MULTICOMP; Manufacturer Part Number: MCMR08X2002FTL; Produktpalette: Baureihe MCMR; Widerstand: 20; Nennleistung: 125; Widerstandstoleranz: ±1%; Bauform: 0805 [Metrisch 2012]; Widerstandselement: Keramik; Temperaturkoeffizient: ±100; Nennspannung: 150; Verpackung: Gurtabschnitt; SVHC: No SVHC (17-Dec-2014); Widerstandsmontage: Oberflächenmontage<!--FANDB--><div class="features-and-benefits-container"></div>; Published: 8-Jun-2000; LatestRevisionDate: 17-Jul-2002; LatestRevisionNote: Re-released for DXP Platform.; PackageReference: AXIAL-0.4; Publisher: Altium Limited; PackageDescription: Axial Device, Thru-Hole; 2 Leads; 0.4 in Pin Spacing; Value: 20k; Supplier 1: Farnell; Supplier Part Number 1: 2073683; RoHS: YES; Stock 1: 12300; Pricing 1: 100=0,014, 500=0,011, 1000=0,01 (EUR); MSL: -; ComponentLink1URL: http://www.farnell.com/datasheets/1716708.pdf; ComponentLink1Description: http://www.farnell.com/datasheets/1716708.pdf
U6 = CMP-0379-00026-1: AR1000 Series Resistive Touch Screen Controller, 1024 x 1024 Resolution, 3.3 Vdc, 5.5 Vdc power, SPI, I²C™ Communication, -40 to 85 degC, 20-pin SSOP (SS20), Tape and Reel; Manufacturer: Microchip; Manufacturer Part Number: AR1021-I/SS; IC-Schnittstelle: I2; Auflösung (Bit): 10; Versorgungsspannung, min.: 2.5; Versorgungsspannung, max.: 5; Anzahl der Pins: 20; Verpackung: Stückweise; SVHC: No SVHC (17-Dec-2014); Betriebstemperatur: -40°C bis +85; Betriebstemperatur, max.: 85; Versorgungsspannung: 2.5V bis 5; Mounting Technology: Surface Mount; ComponentLink4Description: Product URL; ComponentLink1Description: Manufacturer URL; PackageReference: SSOP-SS20; PartNumber: AR1021T-I/SS; DatasheetVersion: Rev. B; ComponentLink4URL: http://www.microchip.com/AR1021; ComponentLink1URL: http://www.microchip.com; PackageVersion: C04-072B; ComponentLink2URL: http://ww1.microchip.com/downloads/en/DeviceDoc/41393B.pdf; PackageDescription: 20-Lead Plastic Shrink Small Outline, 5.3 x 7.2 mm Body, 0.65 mm Pitch; ComponentLink3Description: Package Specification; ComponentLink3URL: http://www.microchip.com/stellent/groups/techpub_sg/documents/packagingspec/en012702.pdf; ComponentLink2Description: Datasheet; Supplier 1: Farnell; Supplier Part Number 1: 2218568; RoHS: YES; Stock 1: 355; Pricing 1: 1=1,85, 10=1,4, 100=1,28 (EUR); Bauform: SSOP; MSL: MSL 1 - unbegrenzt; Betriebstemperatur, min.: -40; Controllertyp: Touchscreen; ComponentLink5URL: http://www.microchip.com/mymicrochip/filehandler.aspx?ddocname=en544070; ComponentLink5Description: http://www.microchip.com/mymicrochip/filehandler.aspx?ddocname=en544070; ComponentLink6URL: http://www.farnell.com/cad/1726657.zip; ComponentLink6Description: http://www.farnell.com/cad/1726657.zip

## Sheet srl.SchDoc: Slow Rate Limit Unit for RS485
size A4; Author: Marcel Hellwig; Organization: Hamburg Bit-Bots; Address1: Vogt-Kölln-Str. 30; Address2: 22527 Hamburg; Address3: Germany; Address4: www.bit-bots.de; DocumentNumber: 12; Revision: A; SheetNumber: 12; SheetTotal: 16; EMail: info@bit-bots.de
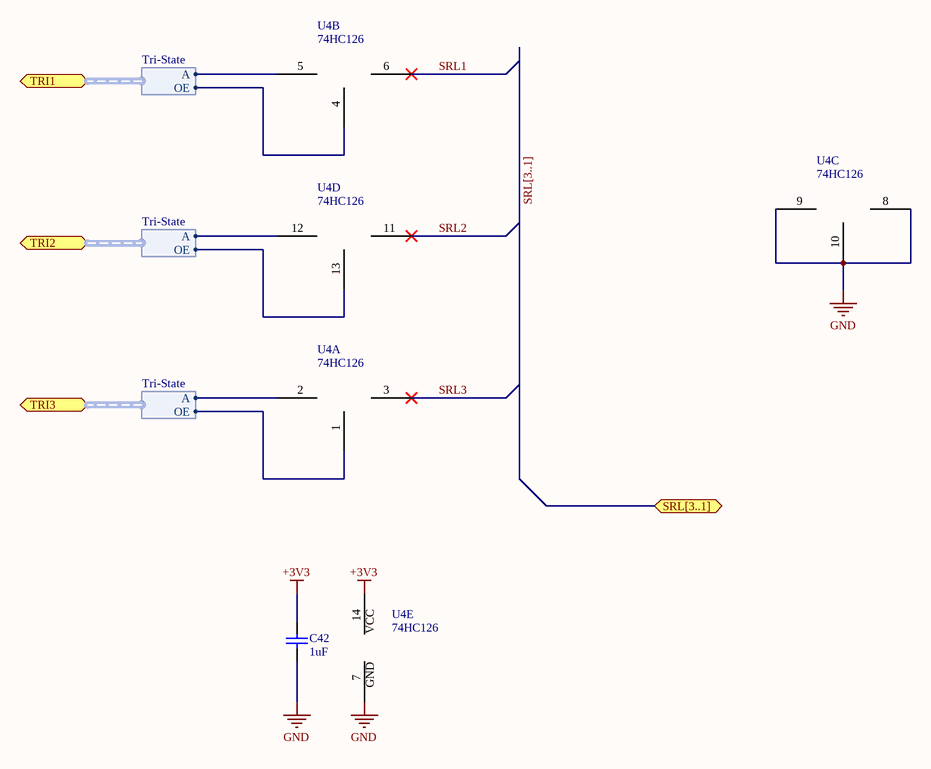
[diagram p5: srl.SchDoc]

### Parts
C42  1uF  [C2012]
U4  74HC126  [SOIC14]  (parts A,B,C,D,E of 5)

### Ports
SRL[3..1], TRI1 (harness Tri-State), TRI2 (harness Tri-State), TRI3 (harness Tri-State)

### Harnesses
Tri-State: A, OE

### Nets
+3V3: C42.1 U4.14(VCC)
GND: C42.2 U4.7(GND) U4.8(Y3) U4.9(A3) U4.10(OE3)
SRL1: U4.6(Y2)
SRL2: U4.11(Y4)
SRL3: U4.3(Y1)
NetU1_63: U4.5(A2) ; port TRI1.A
NetU1_64: U4.4(OE2) ; port TRI1.OE
NetU1_65: U4.12(A4) ; port TRI2.A
NetU1_66: U4.13(OE4) ; port TRI2.OE
NetU1_67: U4.2(A1) ; port TRI3.A
NetU1_68: U4.1(OE1) ; port TRI3.OE

### Buses and harness runs
bus SRL[3..1] = port SRL[3..1]

### Notes on the sheet
- Project:
- Author:
- Title:
- Rev:
- Date:
- Time:
- Sheet
- of

### Library data of the parts
C42 = Cap: as C41 on sheet rs485; Published: 8-Jun-2000; LatestRevisionDate: 17-Jul-2002; LatestRevisionNote: Re-released for DXP Platform.; PackageReference: RAD-0.3; Publisher: Altium Limited; PackageDescription: Radial Cap, Thru-Hole; 2 Leads; 0.3 in Pin Spacing; Value: 1uF; Supplier 1: Farnell; Supplier Part Number 1: 2320827; RoHS: YES; Stock 1: 4031; Pricing 1: 10=0,06, 100=0,05, 500=0,041, 1000=0,034, 1500=0,027 (EUR); MSL: MSL 1 - unbegrenzt; Bauform: 0805 [Metrisch 2012]; Kapazitätstoleranz ±: ±10%; ComponentLink1URL: http://www.farnell.com/datasheets/1870456.pdf; ComponentLink1Description: http://www.farnell.com/datasheets/1870456.pdf
U4 = 74HC126: as U5 on sheet ttl; Supplier 1: Farnell; Supplier Part Number 1: 1085233; RoHS: YES; Stock 1: 198; Pricing 1: 1=0,444, 10=0,311, 100=0,214, 200=0,193, 500=0,173, 2000=0,155, 5000=0,0826, 20000=0,0733 (EUR); ComponentLink1URL: http://www.farnell.com/datasheets/1852048.pdf; ComponentLink1Description: http://www.farnell.com/datasheets/1852048.pdf; ComponentLink2URL: http://www.farnell.com/cad/1638396.zip; ComponentLink2Description: http://www.farnell.com/cad/1638396.zip

## Sheet voltage_translation.SchDoc: Voltage-Data-Translation
size A4; Author: Marcel Hellwig; Organization: Hamburg Bit-Bots; Address1: Vogt-Kölln-Str. 30; Address2: 22527 Hamburg; Address3: Germany; Address4: www.bit-bots.de; DocumentNumber: 15; Revision: A; SheetNumber: 15; SheetTotal: 16; EMail: info@bit-bots.de
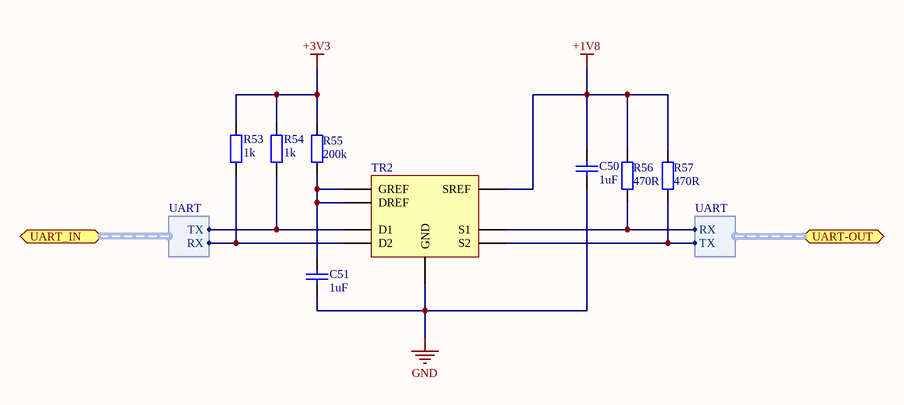
[diagram p6: voltage_translation.SchDoc]

### Parts
C50  1uF  [C2012]
C51  1uF  [C2012]
R53  1k  [R2012]
R54  1k  [R2012]
R55  200k  [R2012]
R56  470R  [R2012]
R57  470R  [R2012]
TR2  GTL2002  [SOIC8]  (value not drawn)

### Ports
UART-OUT (harness UART), UART_IN (harness UART)

### Harnesses
UART: RX, TX

### Nets
+1V8: C50.1 R56.2 R57.2 TR2.2(SREF)
+3V3: R53.1 R54.1 R55.2
GND: C50.2 C51.2 TR2.1(GND)
NetC51_1: C51.1 R55.1 TR2.7(DREF) TR2.8(GREF)
NetP1_B45: R56.1 TR2.3(S1) ; port UART-OUT.RX
NetP1_B46: R57.1 TR2.4(S2) ; port UART-OUT.TX
NetR53_2: R53.2 TR2.5(D2) ; port UART_IN.RX
NetR54_2: R54.2 TR2.6(D1) ; port UART_IN.TX

### Notes on the sheet
- Project:
- Author:
- Title:
- Rev:
- Date:
- Time:
- Sheet
- of

### Library data of the parts
C50 C51 = Cap: as C41 on sheet rs485; Published: 8-Jun-2000; LatestRevisionDate: 17-Jul-2002; LatestRevisionNote: Re-released for DXP Platform.; PackageReference: RAD-0.3; Publisher: Altium Limited; PackageDescription: Radial Cap, Thru-Hole; 2 Leads; 0.3 in Pin Spacing; Value: 1uF; Supplier 1: Farnell; Supplier Part Number 1: 2320827; RoHS: YES; Stock 1: 4031; Pricing 1: 10=0,06, 100=0,05, 500=0,041, 1000=0,034, 1500=0,027 (EUR); MSL: MSL 1 - unbegrenzt; Bauform: 0805 [Metrisch 2012]; Kapazitätstoleranz ±: ±10%; ComponentLink1URL: http://www.farnell.com/datasheets/1870456.pdf; ComponentLink1Description: http://www.farnell.com/datasheets/1870456.pdf
R53 R54 = Res2: as R47 on sheet connector; Published: 8-Jun-2000; LatestRevisionDate: 17-Jul-2002; LatestRevisionNote: Re-released for DXP Platform.; PackageReference: AXIAL-0.4; Publisher: Altium Limited; PackageDescription: Axial Device, Thru-Hole; 2 Leads; 0.4 in Pin Spacing; Value: 1k; Supplier 1: Farnell; Supplier Part Number 1: 9332391; RoHS: Y-EX; Stock 1: 4370; Pricing 1: 50=0,038, 250=0,031, 1000=0,022, 5000=0,014, 15000=0,009 (EUR); ComponentLink1URL: http://www.farnell.com/datasheets/1729047.pdf; ComponentLink1Description: http://www.farnell.com/datasheets/1729047.pdf; ComponentLink2URL: http://www.farnell.com/cad/1561156.zip; ComponentLink2Description: http://www.farnell.com/cad/1561156.zip
R55 = Res2: Resistor; Manufacturer: MULTICOMP; Manufacturer Part Number: MCSR08X2003FTL; Produktpalette: Baureihe MCSR 08; Widerstand: 200; Nennleistung: 125; Widerstandstoleranz: ±1%; Bauform: 0805 [Metrisch 2012]; Widerstandselement: Keramik; Temperaturkoeffizient: ±100; Nennspannung: 150; Verpackung: Gurtabschnitt; SVHC: No SVHC (17-Dec-2014); Widerstandsmontage: Oberflächenmontage<!--FANDB--><div class="features-and-benefits-container"></div>; Published: 8-Jun-2000; LatestRevisionDate: 17-Jul-2002; LatestRevisionNote: Re-released for DXP Platform.; PackageReference: AXIAL-0.4; Publisher: Altium Limited; PackageDescription: Axial Device, Thru-Hole; 2 Leads; 0.4 in Pin Spacing; Value: 200k; Supplier 1: Farnell; Supplier Part Number 1: 2074396; RoHS: YES; Stock 1: 2500; Pricing 1: 100=0,011, 500=0,01, 1000=0,009 (EUR); MSL: -; ComponentLink1URL: http://www.farnell.com/datasheets/1716717.pdf; ComponentLink1Description: http://www.farnell.com/datasheets/1716717.pdf
R56 R57 = Res2: Resistor; Manufacturer: MULTICOMP; Manufacturer Part Number: MCSR08X4700FTL; Produktpalette: Baureihe MCSR 08; Widerstand: 470; Nennleistung: 125; Widerstandstoleranz: ±1%; Bauform: 0805 [Metrisch 2012]; Widerstandselement: Keramik; Temperaturkoeffizient: ±100; Nennspannung: 150; Verpackung: Gurtabschnitt; SVHC: No SVHC (17-Dec-2014); Widerstandsmontage: Oberflächenmontage<!--FANDB--><div class="features-and-benefits-container"></div>; Published: 8-Jun-2000; LatestRevisionDate: 17-Jul-2002; LatestRevisionNote: Re-released for DXP Platform.; PackageReference: AXIAL-0.4; Publisher: Altium Limited; PackageDescription: Axial Device, Thru-Hole; 2 Leads; 0.4 in Pin Spacing; Value: 470R; Supplier 1: Farnell; Supplier Part Number 1: 2074468; RoHS: YES; Stock 1: 1200; Pricing 1: 100=0,011, 500=0,01, 1000=0,009 (EUR); MSL: -; ComponentLink1URL: http://www.farnell.com/datasheets/1716717.pdf; ComponentLink1Description: http://www.farnell.com/datasheets/1716717.pdf
TR2 = GTL2002: 2-bit bidirectional lo  w voltage translator; Supplier 1: Farnell; Supplier Part Number 1: 2212066

## Sheet uc1.SchDoc: Microcontroller 1
size A4; Author: Marcel Hellwig; Organization: Hamburg Bit-Bots; Address1: Vogt-Kölln-Str. 30; Address2: 22527 Hamburg; Address3: Germany; Address4: www.bit-bots.de; DocumentNumber: 2; Revision: A; SheetNumber: 2; SheetTotal: 16; EMail: info@bit-bots.de
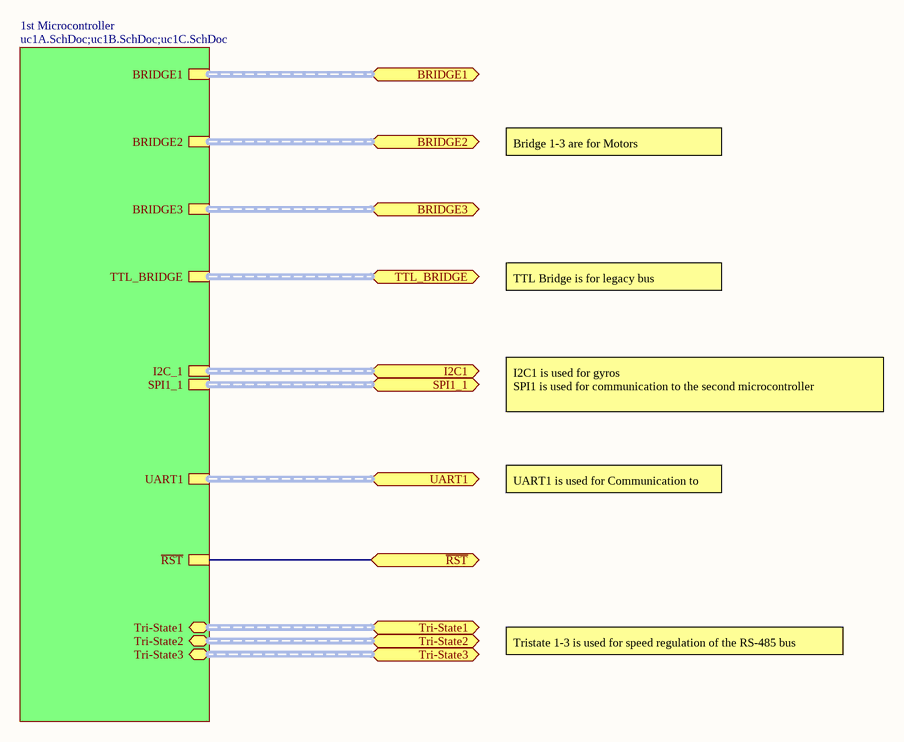
[diagram p7: uc1.SchDoc]

### Sub-sheets
1st Microcontroller = uc1A.SchDoc;uc1B.SchDoc;uc1C.SchDoc: SPI1_1 (harness SPI), I2C_1 (harness I²C), BRIDGE2 (harness UART_RS485), UART1 (harness UART), BRIDGE1 (harness UART_RS485), BRIDGE3 (harness UART_RS485), TTL_BRIDGE (harness TTL), ~{RST}, Tri-State1 (harness Tri-State), Tri-State2 (harness Tri-State), Tri-State3 (harness Tri-State)

### Ports
BRIDGE1 (harness UART_RS485), BRIDGE2 (harness UART_RS485), BRIDGE3 (harness UART_RS485), I2C1 (harness I²C), SPI1_1 (harness SPI), Tri-State1 (harness Tri-State), Tri-State2 (harness Tri-State), Tri-State3 (harness Tri-State), TTL_BRIDGE (harness TTL), UART1 (harness UART), ~{RST}

### Nets
~{RST}: port ~{RST}, sheet 1st Microcontroller/~{RST}

### Buses and harness runs
harness port BRIDGE1 = sheet 1st Microcontroller/BRIDGE1
harness port BRIDGE2 = sheet 1st Microcontroller/BRIDGE2
harness port BRIDGE3 = sheet 1st Microcontroller/BRIDGE3
harness port I2C1 = sheet 1st Microcontroller/I2C_1
harness port SPI1_1 = sheet 1st Microcontroller/SPI1_1
harness port Tri-State1 = sheet 1st Microcontroller/Tri-State1
harness port Tri-State2 = sheet 1st Microcontroller/Tri-State2
harness port Tri-State3 = sheet 1st Microcontroller/Tri-State3
harness port TTL_BRIDGE = sheet 1st Microcontroller/TTL_BRIDGE
harness port UART1 = sheet 1st Microcontroller/UART1

### Notes on the sheet
- Bridge 1-3 are for Motors
- TTL Bridge is for legacy bus
- I2C1 is used for gyros
  SPI1 is used for communication to the second microcontroller
- UART1 is used for Communication to the odroid
- Tristate 1-3 is used for speed regulation of the RS-485 bus
- Project:
- Author:
- Title:
- Rev:
- Date:
- Time:
- Sheet
- of

## Sheet uc1A.SchDoc: Microcontroller 1 (Part A)
size A4; Author: Marcel Hellwig; Organization: Hamburg Bit-Bots; Address1: Vogt-Kölln-Str. 30; Address2: 22527 Hamburg; Address3: Germany; Address4: www.bit-bots.de; DocumentNumber: 3; Revision: A; SheetNumber: 3; SheetTotal: 16; EMail: info@bit-bots.de
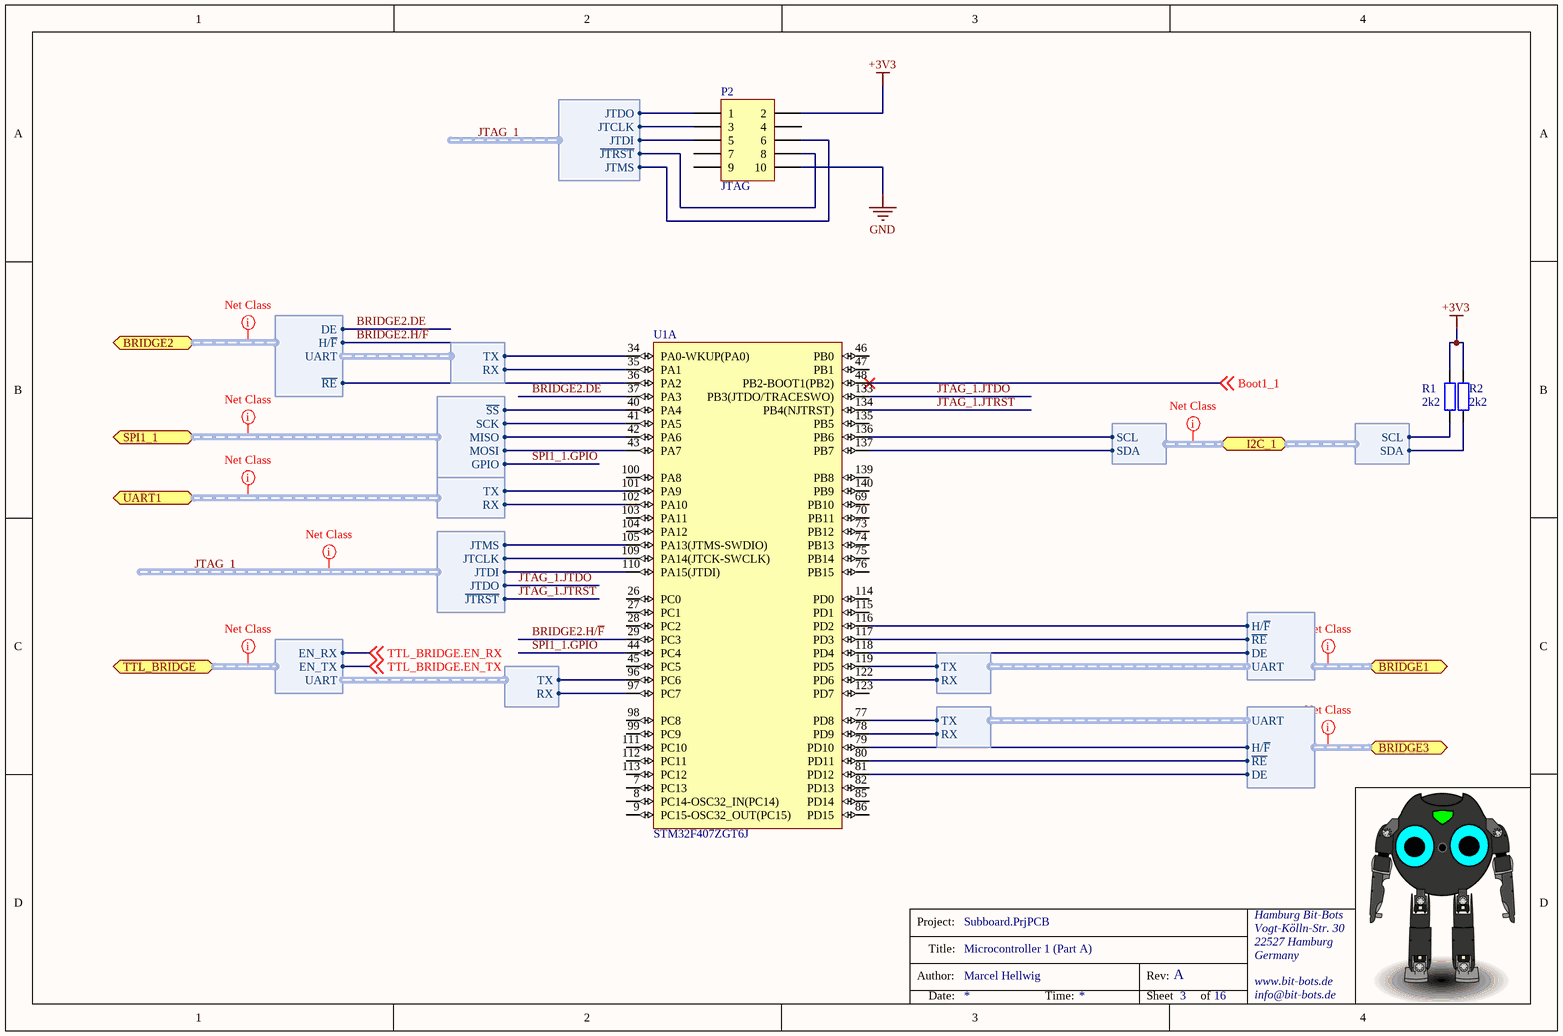
[diagram p8: uc1A.SchDoc]

### Parts
P2  JTAG  [HDR2X5]  (no BOM)
R1  2k2  [R2012]
R2  2k2  [R2012]
U1  STM32F407ZGT6J  [STM-LQFP144_M]  (part A of 3)

### Ports
BRIDGE1 (harness UART_RS485), BRIDGE2 (harness UART_RS485), BRIDGE3 (harness UART_RS485), I2C_1 (harness I²C), SPI1_1 (harness SPI), TTL_BRIDGE (harness TTL), UART1 (harness UART)

### Harnesses
UART: TX, RX
SPI: ~{SS}, SCK, MISO, MOSI, GPIO
I²C: SCL, SDA
UART_RS485: UART, DE, ~{RE}, H/~{F}
UART_RS485: ~{RE}, UART, DE, H/~{F}
JTAG: ~{JTRST}, JTCLK, JTDI, JTDO, JTMS
TTL: UART, EN_TX, EN_RX

### Nets
+3V3: P2.2 R1.1 R2.2
GND: P2.10
Boot1_1: U1.48(PB2-BOOT1(PB2)) ; off-sheet Boot1_1
BRIDGE2.DE: U1.37(PA3) ; port BRIDGE2.DE
BRIDGE2.H/~{F}: U1.29(PC3) ; port BRIDGE2.H/~{F}
JTAG_1~{.}JTRST: P2.8 U1.134(PB4(NJTRST)) ; harness JTAG.~{JTRST}
JTAG_1.JTCLK: P2.3 U1.109(PA14(JTCK-SWCLK)) ; harness JTAG.JTCLK
JTAG_1.JTDI: P2.5 U1.110(PA15(JTDI)) ; harness JTAG.JTDI
JTAG_1.JTDO: P2.1 U1.133(PB3(JTDO/TRACESWO)) ; harness JTAG.JTDO
JTAG_1.JTMS: P2.6 U1.105(PA13(JTMS-SWDIO)) ; harness JTAG.JTMS
SPI1_1.GPIO: U1.44(PC4) ; port SPI1_1.GPIO
TTL_BRIDGE.EN_RX: off-sheet TTL_BRIDGE.EN_RX, port TTL_BRIDGE.EN_RX
TTL_BRIDGE.EN_TX: off-sheet TTL_BRIDGE.EN_TX, port TTL_BRIDGE.EN_TX
NetP1_B48: R1.2 U1.136(PB6) ; port I2C_1.SCL
NetP1_B49: R2.1 U1.137(PB7) ; port I2C_1.SDA
NetR53_2: U1.102(PA10) ; port UART1.RX
NetR54_2: U1.101(PA9) ; port UART1.TX
NetTR11_1: U1.116(PD2) ; port BRIDGE1.H/~{F}
NetTR11_2: U1.122(PD6) ; harness UART.RX
NetTR11_3: U1.117(PD3) ; port BRIDGE1.~{RE}
NetTR11_4: U1.118(PD4) ; port BRIDGE1.DE
NetTR11_5: U1.119(PD5) ; harness UART.TX
NetTR12_2: U1.35(PA1) ; harness UART.RX
NetTR12_3: U1.36(PA2) ; port BRIDGE2.~{RE}
NetTR12_5: U1.34(PA0-WKUP(PA0)) ; harness UART.TX
NetTR13_1: U1.79(PD10) ; port BRIDGE3.H/~{F}
NetTR13_2: U1.78(PD9) ; harness UART.RX
NetTR13_3: U1.80(PD11) ; port BRIDGE3.~{RE}
NetTR13_4: U1.81(PD12) ; port BRIDGE3.DE
NetTR13_5: U1.77(PD8) ; harness UART.TX
NetU1_40: U1.40(PA4) ; port SPI1_1.~{SS}
NetU1_41: U1.41(PA5) ; port SPI1_1.SCK
NetU1_42: U1.42(PA6) ; port SPI1_1.MISO
NetU1_43: U1.43(PA7) ; port SPI1_1.MOSI
NetU1_96: U1.96(PC6) ; harness UART.TX
NetU1_97: U1.97(PC7) ; harness UART.RX

Not connected (* = marked no-connect by the designer): P2 4 7 9; U1 7(PC13) 8(PC14-OSC32_IN(PC14)) 9(PC15-OSC32_OUT(PC15)) 26(PC0) 27(PC1) 28(PC2) 45(PC5) 46(PB0) 47(PB1) 69(PB10) 70(PB11) 73(PB12) 74(PB13) 75(PB14) 76(PB15) 82(PD13) 85(PD14) 86(PD15) 98(PC8) 99(PC9) 100(PA8) 103(PA11) 104(PA12) 111(PC10) 112(PC11) 113(PC12) 114(PD0) 115(PD1) 123(PD7) 135(PB5) 139(PB8) 140(PB9)

### Layout directives
net class I2C: (no net found under the mark)
net class UART; net class Bridge2: (no net found under the mark)
net class SPI; net class SPI1: (no net found under the mark)
net class UART; net class UART1: (no net found under the mark)
net class UART; net class Bridge1: (no net found under the mark)
net class UART; net class Bridge3: (no net found under the mark)
net class JTAG: (no net found under the mark)
net class TTL: (no net found under the mark)

### Notes on the sheet
- Project:
- Author:
- Title:
- Rev:
- Date:
- Time:
- Sheet
- of

### Library data of the parts
P2 = Header 5X2: Header, 5-Pin, Dual row; LatestRevisionDate: 17-Jul-2002; LatestRevisionNote: Re-released for DXP Platform.; Publisher: Altium Limited
R1 R2 = Res2: Resistor; Manufacturer: MULTICOMP; Manufacturer Part Number: MCMR08X2201FTL; Produktpalette: Baureihe MCMR; Widerstand: 2.2; Nennleistung: 125; Widerstandstoleranz: ±1%; Bauform: 0805 [Metrisch 2012]; Widerstandselement: Keramik; Temperaturkoeffizient: ±100; Nennspannung: 150; Verpackung: Gurtabschnitt; SVHC: No SVHC (17-Dec-2014); Widerstandsmontage: Oberflächenmontage<!--FANDB--><div class="features-and-benefits-container"></div>; Published: 8-Jun-2000; LatestRevisionDate: 17-Jul-2002; LatestRevisionNote: Re-released for DXP Platform.; PackageReference: AXIAL-0.4; Publisher: Altium Limited; PackageDescription: Axial Device, Thru-Hole; 2 Leads; 0.4 in Pin Spacing; Value: 2k2; Supplier 1: Farnell; Supplier Part Number 1: 2073690; RoHS: YES; Stock 1: 38600; Pricing 1: 100=0,014, 500=0,011, 1000=0,01 (EUR); MSL: -; ComponentLink1URL: http://www.farnell.com/datasheets/1716708.pdf; ComponentLink1Description: http://www.farnell.com/datasheets/1716708.pdf
U1 = CMP-0243-00063-2: ARM Cortex-M4 32-bit MCU+FPU, 210 DMIPS, 1024 kB Flash, 192 kB Internal RAM, 114 I/Os, 144-pin LQFP, -40 to 85 degC, Tray; Manufacturer: STMicroelectronics; I/Os (High Current): 114; D/A Converter: 2x12-bit; Internal RAM Size (kB): 192; Operating Frequency(F) (Processor speed) (MHz): 168; Supply Voltage(Vcc) max (V): 3.6; Supply Voltage(Vcc) min (V): 1.8; FLASH Size (Prog) (kB): 1024; ComponentLink3Description: Package Specification; PackageVersion: Rev. 4, 06/2013; PartNumber: STM32F407ZGT6J; ComponentLink3URL: http://www.st.com/st-web-ui/static/active/en/resource/technical/document/datasheet/DM00037051.pdf; PackageReference: LQFP144; ComponentLink2URL: http://www.st.com/st-web-ui/static/active/en/resource/technical/document/datasheet/DM00037051.pdf; ComponentLink2Description: Datasheet; ComponentLink1Description: Manufacturer URL; Mounting Technology: Surface Mount; Core: ARM Cortex-M4; PackageDescription: 144-Pin Low Profile Quad Flat Package, 20 x 20 mm Body, 0.5 mm Pitch; Packing: Tray; ComponentLink1URL: http://www.st.com/web/en/home.html; DatasheetVersion: Rev. 4; PartId: 1; Supplier 1: Farnell; Supplier Part Number 1: 2333299